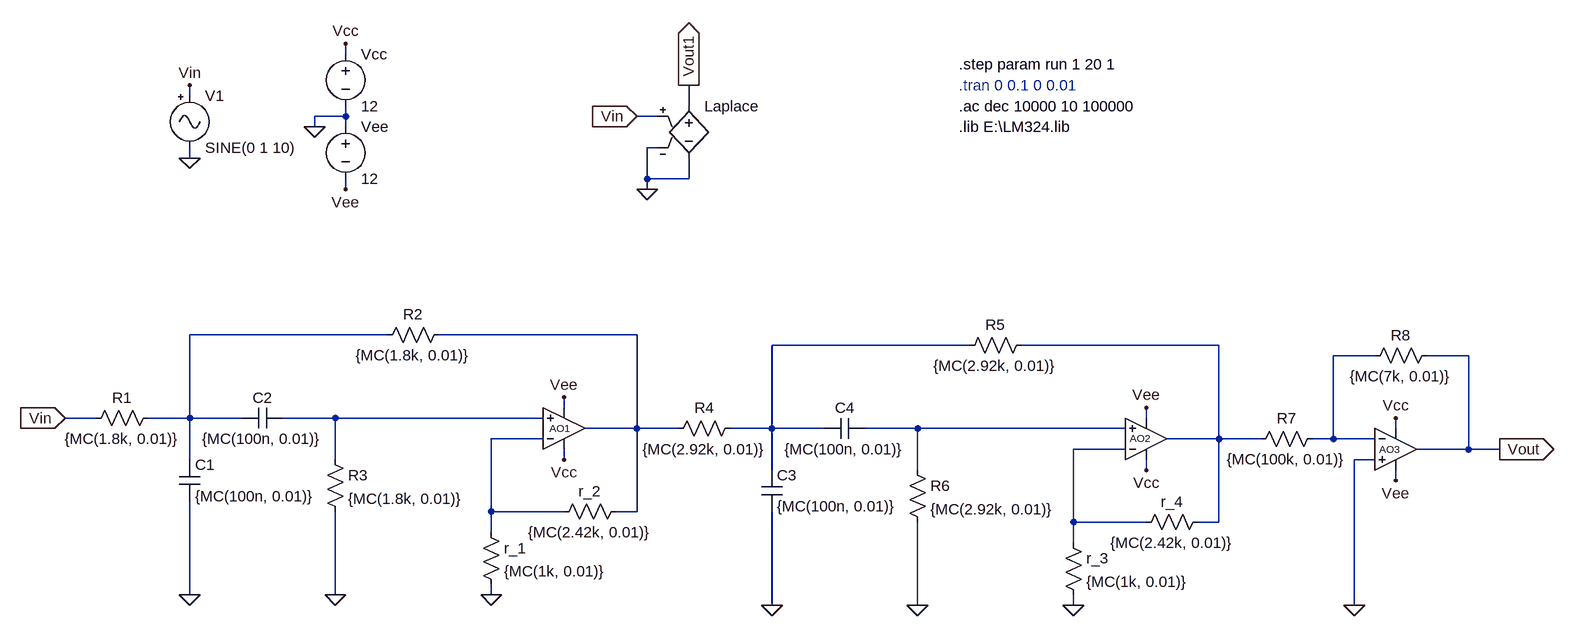
[diagram p0: schematic Filtros_MonteCarlo.asc]
Filtros_MonteCarlo.asc, the LTspice schematic file:
Version 4.1
SHEET 1 1440 724
WIRE -448 -480 -448 -496
WIRE -688 -416 -688 -432
WIRE 80 -400 80 -432
WIRE -448 -384 -448 -400
WIRE -448 -384 -496 -384
WIRE 32 -384 0 -384
WIRE -496 -368 -496 -384
WIRE -448 -368 -448 -384
WIRE 32 -336 16 -336
WIRE -688 -320 -688 -336
WIRE 16 -288 16 -336
WIRE 80 -288 80 -320
WIRE 80 -288 16 -288
WIRE -448 -272 -448 -288
WIRE 16 -272 16 -288
WIRE -384 -48 -688 -48
WIRE 0 -48 -304 -48
WIRE 512 -32 208 -32
WIRE 896 -32 592 -32
WIRE 1136 -16 1072 -16
WIRE 1280 -16 1216 -16
WIRE -112 64 -112 48
WIRE -832 80 -880 80
WIRE -688 80 -688 -48
WIRE -688 80 -752 80
WIRE -608 80 -688 80
WIRE -464 80 -544 80
WIRE -144 80 -464 80
WIRE 784 80 784 64
WIRE 0 96 0 -48
WIRE 0 96 -80 96
WIRE 64 96 0 96
WIRE 208 96 208 -32
WIRE 208 96 144 96
WIRE 288 96 208 96
WIRE 432 96 352 96
WIRE 752 96 432 96
WIRE 1168 96 1168 80
WIRE -144 112 -224 112
WIRE 896 112 896 -32
WIRE 896 112 816 112
WIRE 960 112 896 112
WIRE 1072 112 1072 -16
WIRE 1072 112 1040 112
WIRE 1136 112 1072 112
WIRE 752 128 672 128
WIRE 1280 128 1280 -16
WIRE 1280 128 1200 128
WIRE 1328 128 1280 128
WIRE -688 144 -688 80
WIRE -464 144 -464 80
WIRE -112 144 -112 128
WIRE 1136 144 1104 144
WIRE 208 160 208 96
WIRE 432 160 432 96
WIRE 784 160 784 144
WIRE 1168 176 1168 160
WIRE -224 224 -224 112
WIRE -112 224 -224 224
WIRE 0 224 0 96
WIRE 0 224 -32 224
WIRE 672 240 672 128
WIRE 784 240 672 240
WIRE 896 240 896 112
WIRE 896 240 864 240
WIRE -224 256 -224 224
WIRE 672 272 672 240
WIRE -688 352 -688 208
WIRE -464 352 -464 224
WIRE -224 352 -224 336
WIRE 208 368 208 224
WIRE 432 368 432 240
WIRE 672 368 672 352
WIRE 1104 368 1104 144
FLAG -496 -368 0
FLAG -448 -496 Vcc
FLAG -448 -272 Vee
FLAG 784 160 Vcc
FLAG 784 64 Vee
FLAG 672 368 0
FLAG 432 368 0
FLAG 208 368 0
FLAG -688 -432 Vin
FLAG -688 -320 0
FLAG 1328 128 Vout
IOPIN 1328 128 Out
FLAG 1168 80 Vcc
FLAG 1168 176 Vee
FLAG 1104 368 0
FLAG 16 -272 0
FLAG 80 -432 Vout1
IOPIN 80 -432 Out
FLAG -112 144 Vcc
FLAG -112 48 Vee
FLAG -224 352 0
FLAG -464 352 0
FLAG -688 352 0
FLAG 0 -384 Vin
IOPIN 0 -384 In
FLAG -880 80 Vin
IOPIN -880 80 In
SYMBOL voltage -448 -496 R0
WINDOW 123 0 0 Left 0
WINDOW 39 0 0 Left 0
SYMATTR InstName Vcc
SYMATTR Value 12
SYMBOL voltage -448 -384 R0
WINDOW 123 0 0 Left 0
WINDOW 39 0 0 Left 0
SYMATTR InstName Vee
SYMATTR Value 12
SYMBOL res 160 80 R90
WINDOW 0 0 56 VBottom 2
WINDOW 3 32 56 VTop 2
SYMATTR InstName R4
SYMATTR Value {MC(2.92k, 0.01)}
SYMBOL res 608 -48 R90
WINDOW 0 0 56 VBottom 2
WINDOW 3 32 56 VTop 2
SYMATTR InstName R5
SYMATTR Value {MC(2.92k, 0.01)}
SYMBOL cap 192 160 R0
SYMATTR InstName C3
SYMATTR Value {MC(100n, 0.01)}
SYMBOL cap 352 80 R90
WINDOW 0 0 32 VBottom 2
WINDOW 3 32 32 VTop 2
SYMATTR InstName C4
SYMATTR Value {MC(100n, 0.01)}
SYMBOL res 416 144 R0
SYMATTR InstName R6
SYMATTR Value {MC(2.92k, 0.01)}
SYMBOL res 880 224 R90
WINDOW 0 0 56 VBottom 2
WINDOW 3 32 56 VTop 2
SYMATTR InstName r_4
SYMATTR Value {MC(2.42k, 0.01)}
SYMBOL res 656 256 R0
SYMATTR InstName r_3
SYMATTR Value {MC(1k, 0.01)}
SYMBOL Misc\\signal -688 -432 R0
WINDOW 39 0 0 Left 0
SYMATTR InstName V1
SYMATTR Value SINE(0 1 10)
SYMATTR Value2 AC 1
SYMBOL res 1056 96 R90
WINDOW 0 0 56 VBottom 2
WINDOW 3 32 56 VTop 2
SYMATTR InstName R7
SYMATTR Value {MC(100k, 0.01)}
SYMBOL res 1232 -32 R90
WINDOW 0 0 56 VBottom 2
WINDOW 3 32 56 VTop 2
SYMATTR InstName R8
SYMATTR Value {MC(7k, 0.01)}
SYMBOL e 80 -416 R0
WINDOW 3 24 96 Invisible 2
SYMATTR Value Laplace{1.642E07*s**2/(s**4 + 5080*s**3 + 9.586E07*s**2 +  2.006E11*s + 1.558E15)}
SYMATTR InstName Laplace
SYMBOL res -736 64 R90
WINDOW 0 0 56 VBottom 2
WINDOW 3 32 56 VTop 2
SYMATTR InstName R1
SYMATTR Value {MC(1.8k, 0.01)}
SYMBOL res -288 -64 R90
WINDOW 0 0 56 VBottom 2
WINDOW 3 32 56 VTop 2
SYMATTR InstName R2
SYMATTR Value {MC(1.8k, 0.01)}
SYMBOL cap -704 144 R0
SYMATTR InstName C1
SYMATTR Value {MC(100n, 0.01)}
SYMBOL cap -544 64 R90
WINDOW 0 0 32 VBottom 2
WINDOW 3 32 32 VTop 2
SYMATTR InstName C2
SYMATTR Value {MC(100n, 0.01)}
SYMBOL res -480 128 R0
SYMATTR InstName R3
SYMATTR Value {MC(1.8k, 0.01)}
SYMBOL res -16 208 R90
WINDOW 0 0 56 VBottom 2
WINDOW 3 32 56 VTop 2
SYMATTR InstName r_2
SYMATTR Value {MC(2.42k, 0.01)}
SYMBOL res -240 240 R0
SYMATTR InstName r_1
SYMATTR Value {MC(1k, 0.01)}
SYMBOL OpAmps\\opamp2 -112 160 M180
WINDOW 0 -22 64 Left 1
WINDOW 3 16 96 Invisible 2
SYMATTR InstName AO1
SYMATTR Value LM324
SYMBOL OpAmps\\opamp2 784 176 M180
WINDOW 0 -25 65 Left 1
WINDOW 3 16 96 Invisible 2
SYMATTR InstName AO2
SYMATTR Value LM324
SYMBOL OpAmps\\opamp2 1168 64 R0
WINDOW 0 -25 64 Left 1
WINDOW 3 16 96 Invisible 2
SYMATTR InstName AO3
SYMATTR Value LM324
TEXT 496 -432 Left 2 ;.tran 0 0.1 0 0.01
TEXT 496 -400 Left 2 !.ac dec 10000 10 100000
TEXT 496 -464 Left 2 !.step param run 1 20 1
TEXT 496 -368 Left 2 !.lib E:\\LM324.lib

The netlist it stands for:
* Filtros_MonteCarlo.asc
Vcc Vcc 0 12
Vee 0 Vee 12
R4 N003 N002 {MC(2.92k, 0.01)}
R5 N004 N003 {MC(2.92k, 0.01)}
C3 N003 0 {MC(100n, 0.01)}
C4 N007 N003 {MC(100n, 0.01)}
R6 N007 0 {MC(2.92k, 0.01)}
r_4 N004 N009 {MC(2.42k, 0.01)}
r_3 N009 0 {MC(1k, 0.01)}
V1 Vin 0 SINE(0 1 10) AC 1
R7 N005 N004 {MC(100k, 0.01)}
R8 Vout N005 {MC(7k, 0.01)}
E§Laplace Vout1 0 Vin 0 Laplace{1.642E07*s**2/(s**4 + 5080*s**3 + 9.586E07*s**2 +  2.006E11*s + 1.558E15)}
R1 N001 Vin {MC(1.8k, 0.01)}
R2 N002 N001 {MC(1.8k, 0.01)}
C1 N001 0 {MC(100n, 0.01)}
C2 N006 N001 {MC(100n, 0.01)}
R3 N006 0 {MC(1.8k, 0.01)}
r_2 N002 N008 {MC(2.42k, 0.01)}
r_1 N008 0 {MC(1k, 0.01)}
X§AO1 N006 N008 Vcc Vee N002 LM324  ; pins In+ In- V+ V- OUT
X§AO2 N007 N009 Vcc Vee N004 LM324  ; pins In+ In- V+ V- OUT
X§AO3 0 N005 Vcc Vee Vout LM324  ; pins In+ In- V+ V- OUT
* .tran 0 0.1 0 0.01
.ac dec 10000 10 100000
.step param run 1 20 1
.lib E:\LM324.lib
.backanno
.end